# EAGLE design ACBoard2 (EAGLE 5.10)
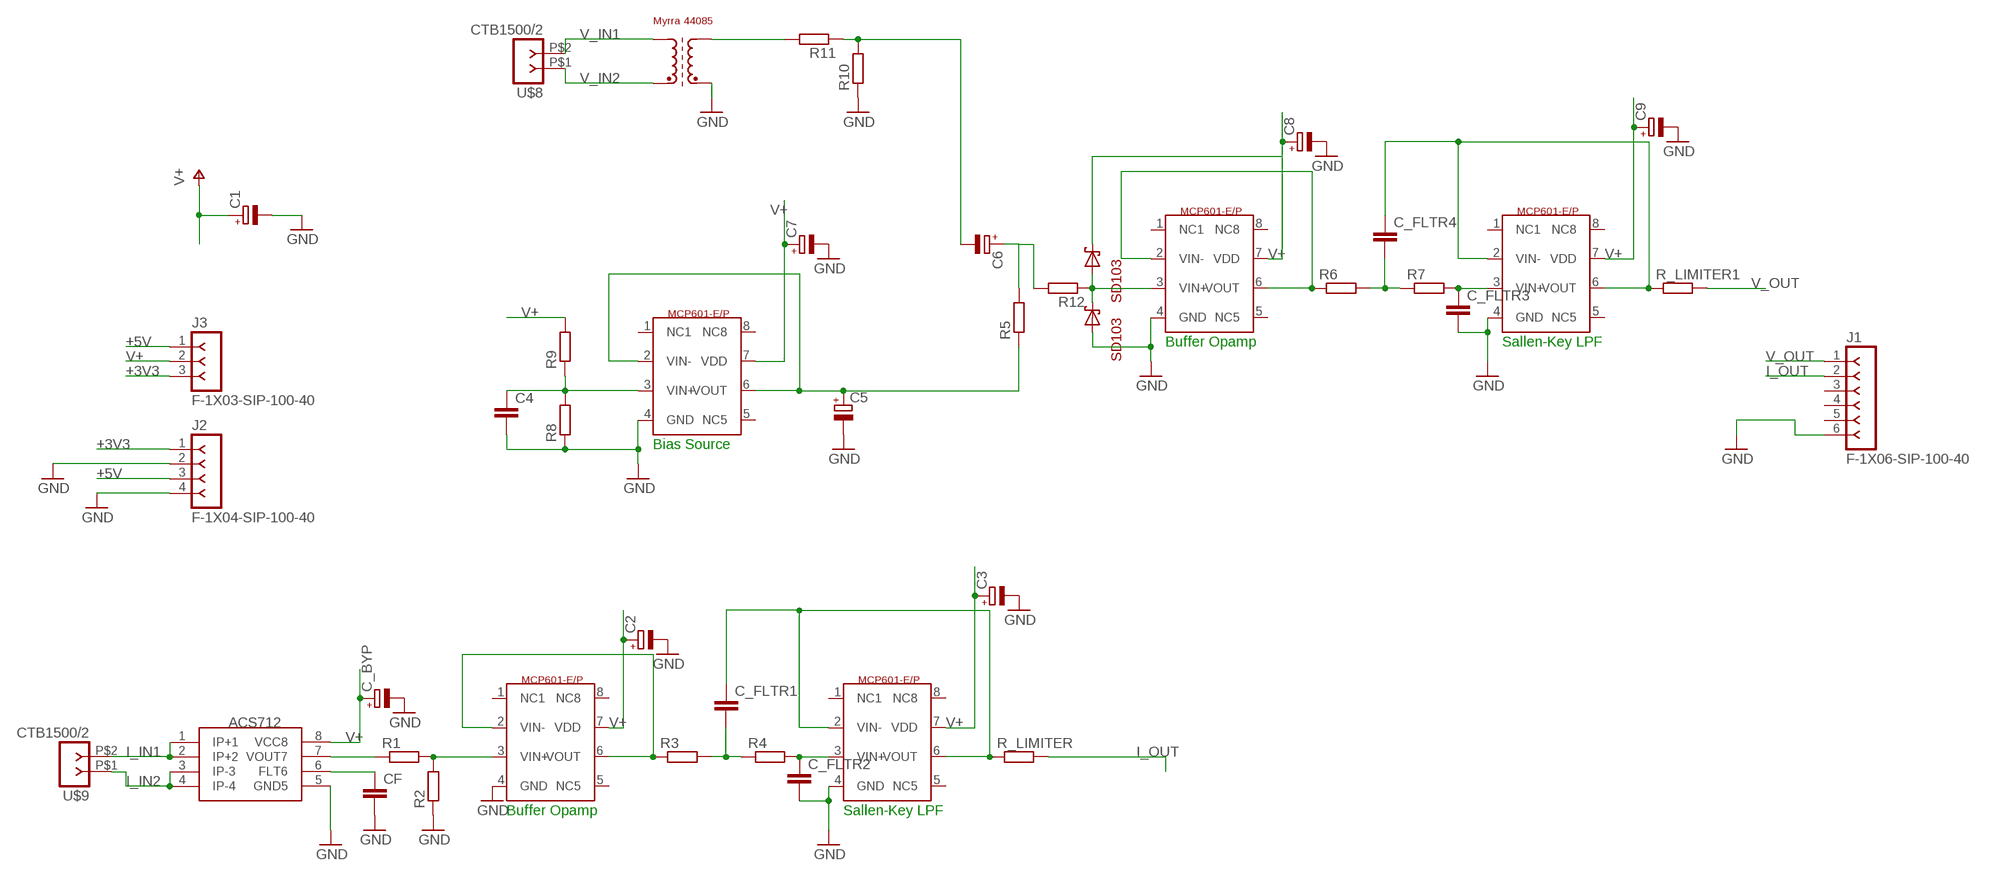
[diagram p0: schematic, sheet 1]

## Parts
BIAS  MCP601  [PDIP8]
C1  CPOL1  [E2,5-7---100UF]
C2  CPOL1  [E2,5-7---100UF]
C3  CPOL1  [E2,5-7---100UF]
C4  C5P  [C050-030-075]
C5  CPOL1  [E2,5-7---100UF]
C6  CPOL1  [E2,5-7---100UF]
C7  CPOL1  [E2,5-7---100UF]
C8  CPOL1  [E2,5-7---100UF]
C9  CPOL1  [E2,5-7---100UF]
C_BYP  CPOL1  [E2,5-7---100UF]
C_FLTR1  C5P  [C050-030-075]
C_FLTR2  C5P  [C050-030-075]
C_FLTR3  C5P  [C050-030-075]
C_FLTR4  C5P  [C050-030-075]
CF  C5P  [C050-030-075]
J1  F-1X06-SIP-100-40  [SIP-100-06-40]
J2  F-1X04-SIP-100-40  [SIP-100-04-40]
J3  F-1X03-SIP-100-40  [SIP-100-03-40]
R1  R  [0207/10]
R2  R  [0207/10]
R3  R  [0207/10]
R4  R  [0207/10]
R5  R  [0207/10]
R6  R  [0207/10]
R7  R  [0207/10]
R8  R  [0207/10]
R9  R  [0207/10]
R10  R  [0207/10]
R11  R  [0207/10]
R12  R  [0207/10]
R_LIMITER  R  [0207/10]
R_LIMITER1  R  [0207/10]
U$1  ACS712  [SOIC8]
U$2  MCP601  [PDIP8]
U$3  MCP601  [PDIP8]
U$4  MCP601  [PDIP8]
U$5  MYRRA_4408  [4408]
U$6  SD103A  [D035-10]
U$7  SD103A  [D035-10]
U$8  CTB1500/2  [CTB1500-2]
U$9  CTB1500/2  [CTB1500-2]
VOLTAGE_FOLLOWER  MCP601  [PDIP8]

## Nets
+3V3: J2.1 J3.3
+5V: J2.3 J3.1
GND: BIAS.4(GND) C1.- C2.- C3.- C4.2 C5.- C7.- C8.- C9.- C_BYP.- C_FLTR2.2 C_FLTR3.2 CF.2 J1.6 J2.2 J2.4 R2.1 R8.1 R10.1 U$1.5(GND5) U$2.4(GND) U$3.4(GND) U$4.4(GND) U$5.PIN9(E2) U$7.A VOLTAGE_FOLLOWER.4(GND)
I_IN1: U$1.1(IP+1) U$1.2(IP+2) U$9.P$2
I_IN2: U$1.3(IP-3) U$1.4(IP-4) U$9.P$1
I_OUT: J1.2 R_LIMITER.2
N$1: CF.1 U$1.6(FLT6)
N$4: R3.1 VOLTAGE_FOLLOWER.2(VIN-) VOLTAGE_FOLLOWER.6(VOUT)
N$5: R1.1 U$1.7(VOUT7)
N$6: R1.2 R2.2 VOLTAGE_FOLLOWER.3(VIN+)
N$7: C_FLTR1.1 R_LIMITER.1 U$3.2(VIN-) U$3.6(VOUT)
N$8: C_FLTR1.2 R3.2 R4.1
N$9: C_FLTR2.1 R4.2 U$3.3(VIN+)
N$10: BIAS.3(VIN+) C4.1 R8.2 R9.1
N$11: BIAS.2(VIN-) BIAS.6(VOUT) C5.+ R5.1
N$12: R12.1 U$2.3(VIN+) U$6.A U$7.C
N$13: R6.1 U$2.2(VIN-) U$2.6(VOUT)
N$14: C_FLTR4.1 R_LIMITER1.1 U$4.2(VIN-) U$4.6(VOUT)
N$15: C_FLTR4.2 R6.2 R7.1
N$16: C_FLTR3.1 R7.2 U$4.3(VIN+)
N$17: C6.- R10.2 R11.1
N$18: R11.2 U$5.PIN7(A2)
N$21: C6.+ R5.2 R12.2
V+: BIAS.7(VDD) C1.+ C2.+ C3.+ C7.+ C8.+ C9.+ C_BYP.+ J3.2 R9.2 U$1.8(VCC8) U$2.7(VDD) U$3.7(VDD) U$4.7(VDD) U$6.C VOLTAGE_FOLLOWER.7(VDD)
V_IN1: U$5.PIN5(A1) U$8.P$2
V_IN2: U$5.PIN1(E1) U$8.P$1
V_OUT: J1.1 R_LIMITER1.2
Unconnected: BIAS.1(NC1) BIAS.5(NC5) BIAS.8(NC8) J1.3 J1.4 J1.5 U$2.1(NC1) U$2.5(NC5) U$2.8(NC8) U$3.1(NC1) U$3.5(NC5) U$3.8(NC8) U$4.1(NC1) U$4.5(NC5) U$4.8(NC8) VOLTAGE_FOLLOWER.1(NC1) VOLTAGE_FOLLOWER.5(NC5) VOLTAGE_FOLLOWER.8(NC8)

## Notes on the sheet
- Buffer Opamp | Sallen-Key LPF
- Bias Source
- Buffer Opamp | Sallen-Key LPF

## Library data of the parts
BIAS U$2-U$4 VOLTAGE_FOLLOWER = Pauls_parts:MCP601
C1-C3 C5-C9 C_BYP = ee2parts:CPOL: Electrolytic (polarised) capacitor
C4 C_FLTR1-C_FLTR4 CF = ee2parts:C: Capacitor
J1 = con-headers-jp:F-1X06-: FEMALE HEADER
J2 = con-headers-jp:F-1X04-: FEMALE HEADER
J3 = con-headers-jp:F-1X03-: FEMALE HEADER
R1-R12 R_LIMITER R_LIMITER1 = ee2parts:R: Resistor
U$1 = Pauls_parts:ACS712
U$5 = Pauls_parts:MYRRA_4408
U$6 U$7 = Pauls_parts:SD103A
U$8 U$9 = eko-parts:CTB1500/2

## Board
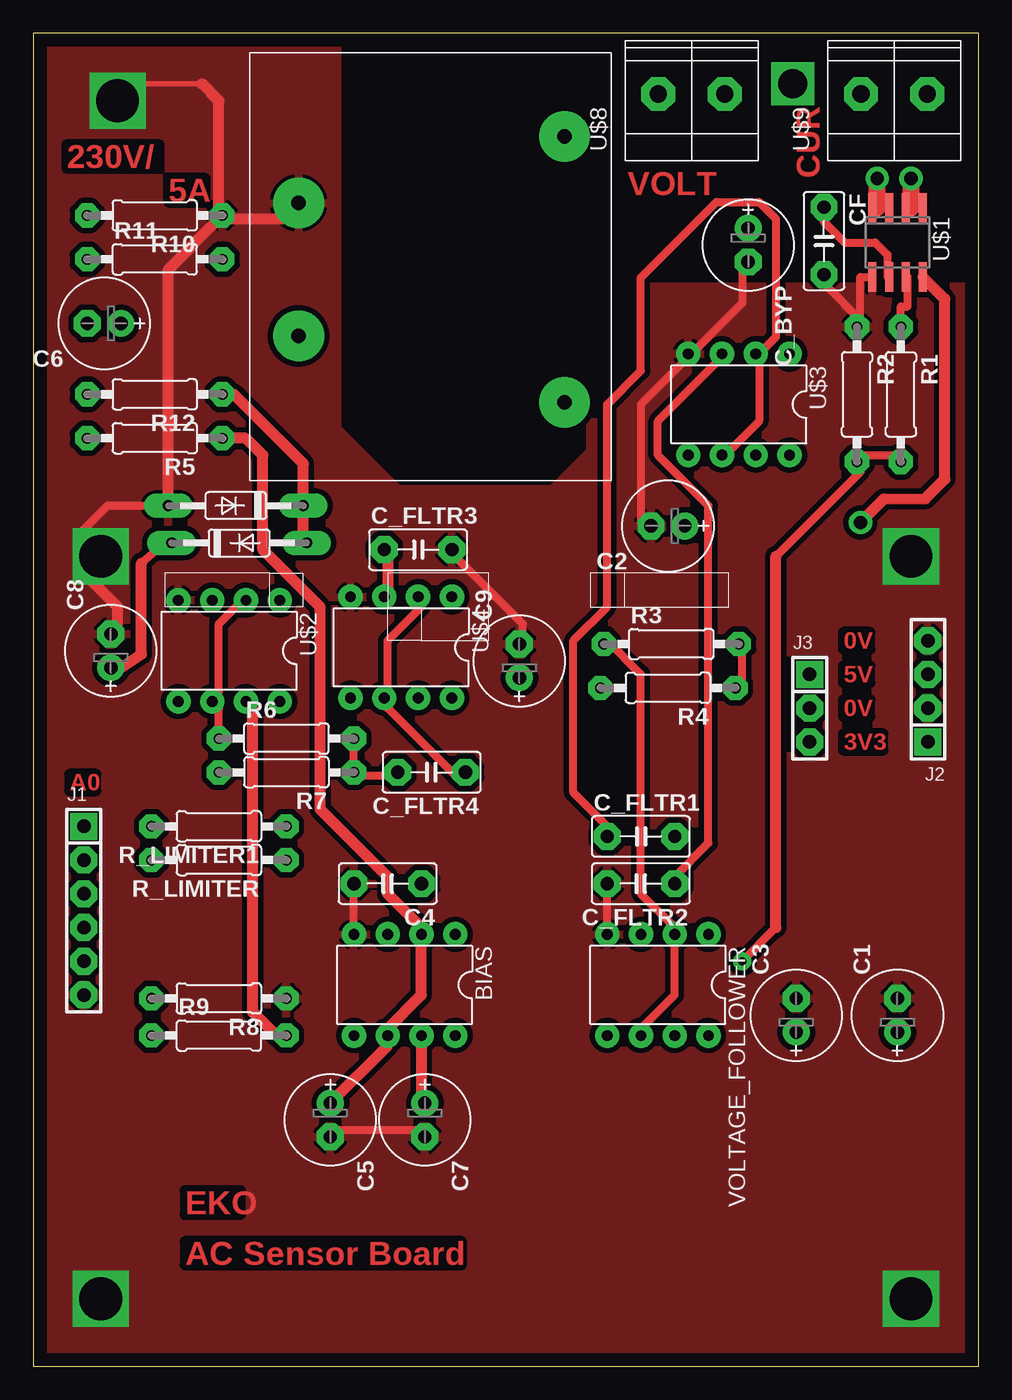
[diagram p1: board, top side]
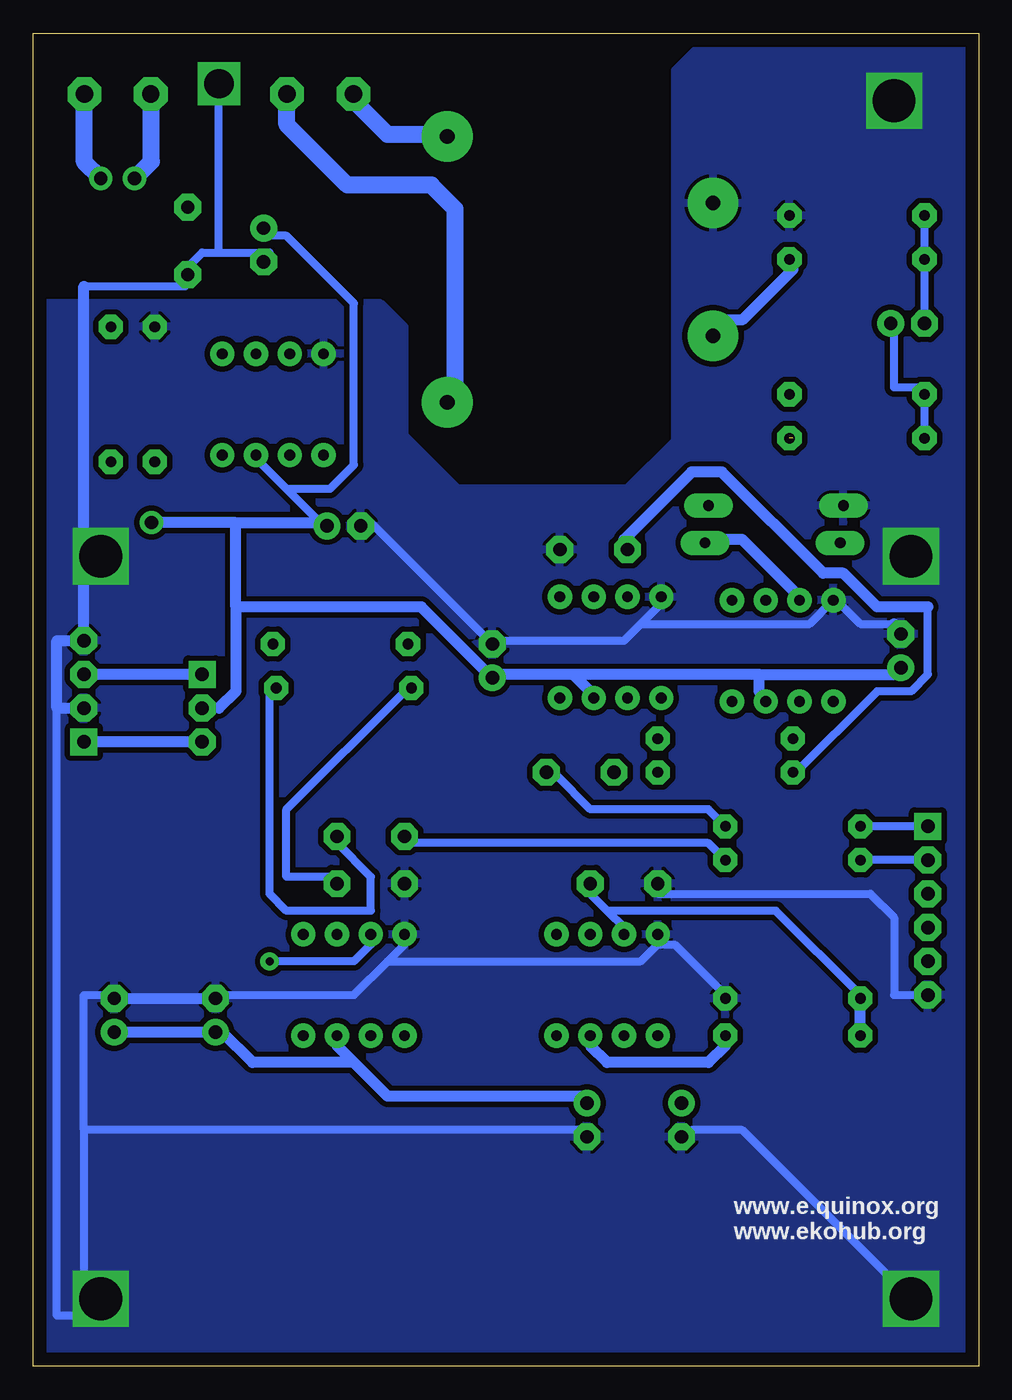
[diagram p2: board, bottom side, seen from below]

Size 71.12 x 100.33 mm. Coordinates in mm from the lower left corner, seen from the top.
Outline: 0,0 71.12,0 71.12,100.33 0,100.33 0,0
Copper layers (1*16): Top 0.035mm / dielectric 1.5mm / Bottom 0.035mm
Design rules "default *": minimum track width 24mil, minimum drill 24mil, track to track 15mil, track to pad 15mil, pad to pad 15mil, via to via 15mil, smd to smd 8mil, copper to edge 40mil, drill to drill 12mil, minimum pad ring 20mil, minimum via ring 15mil, stop-mask expansion 4mil, vias tented up to drill 0mil, thermal gap 10mil
vRestrict: area 48.3,69.8 to 58.4,74.9; area 8.9,49.5 to 20.3,57.2; area 21.6,50.8 to 33,57.1; area 41.9,25.7 to 52.1,33.3; area 22.9,25.4 to 33,31.8

### Footprints (pad centres in the part's own frame; a part is rotated, then mirrored left to right if it is on the bottom)
PDIP8 = drill 0.813 pad 1.27 round: 1 -3.81,-3.81; 2 -1.27,-3.81; 3 1.27,-3.81; 4 3.81,-3.81; 5 3.81,3.81; 6 1.27,3.81; 7 -1.27,3.81; 8 -3.81,3.81
E2,5-7---100UF = drill 1 pad 1.6 round: + -1.27,0 | drill 1 pad 1.6 octagon: - 1.27,0
C050-030-075 = drill 1 octagon: 1 -2.54,0; 2 2.54,0
SIP-100-06-40 = drill 1.016 pad 1.778 square: 1 -6.35,0 | drill 1.016 pad 1.778 octagon: 2 -3.81,0; 3 -1.27,0; 4 1.27,0; 5 3.81,0; 6 6.35,0
SIP-100-04-40 = drill 1.016 pad 1.778 square: 1 -3.81,0 | drill 1.016 pad 1.778 octagon: 2 -1.27,0; 3 1.27,0; 4 3.81,0
SIP-100-03-40 = drill 1.016 pad 1.778 square: 1 -2.54,0 | drill 1.016 pad 1.778 octagon: 2 0,0; 3 2.54,0
0207/10 = drill 0.8 octagon: 1 -5.08,0; 2 5.08,0
SOIC8 = smd 0.6 x 2.2: 1 -1.905,-2.6; 2 -0.635,-2.6; 3 0.635,-2.6; 4 1.905,-2.6; 5 1.905,2.6; 6 0.635,2.6; 7 -0.635,2.6; 8 -1.905,2.6
4408 = drill 1.1 pad 3.81 round: PIN1 -10,10; PIN5 10,10; PIN7 5,-10; PIN9 -5,-10
D035-10 = drill 0.813 long: A 4.318,0.762; C -5.842,0.762
CTB1500-2 = drill 1.3 pad 2.54 octagon: P$1 -2.5,0.5; P$2 2.5,0.5

### Placement (x,y rotation side)
BIAS  27.94,28.7 180 top
C1  65.02,26.42 90 top
C2  47.75,63.25 180 top
C3  57.4,26.42 90 top
C4  26.67,36.32 180 top
C5  22.35,18.54 270 top
C6  5.33,78.49 180 top
C7  29.46,18.54 270 top
C8  5.84,53.85 90 top
C9  36.58,53.09 90 top
C_BYP  53.79,84.39 270 top
C_FLTR1  45.72,39.88 0 top
C_FLTR2  45.72,36.32 180 top
C_FLTR3  28.96,61.47 0 top
C_FLTR4  29.97,44.7 180 top
CF  59.49,84.69 270 top
J1  3.81,34.29 270 top
J2  67.31,50.8 90 top
J3  58.42,49.53 270 top
R1  65.28,73.15 270 top
R2  61.98,73.15 270 top
R3  48.01,54.36 0 top
R4  47.75,51.05 180 top
R5  9.14,69.85 180 top
R6  19.05,47.24 0 top
R7  19.05,44.7 180 top
R8  13.97,27.69 180 top
R9  13.97,24.89 0 top
R10  9.14,86.61 180 top
R11  9.14,83.31 0 top
R12  9.14,73.15 180 top
R_LIMITER  13.97,38.1 180 top
R_LIMITER1  13.97,40.64 180 top
U$1  65.02,84.58 180 top
U$2  14.73,53.85 180 top
U$3  53.09,72.39 180 top
U$4  27.69,54.1 180 top
U$5  29.97,82.55 270 top
U$6  16.26,61.21 0 top
U$7  14.48,65.53 180 top
U$8  49.53,95.25 0 top
U$9  64.77,95.25 0 top
VOLTAGE_FOLLOWER  46.99,28.7 180 top

### Tracks (layer width: path | path; a pad name or v marks a point on that pad's centre or on a via)
+3V3
  Bottom 0.813: J3.3 J2.1
+5V
  Bottom 0.813: J3.1 J2.3
GND  (via drill 2.2 pad 0.41, 3.2 pad 0.41)
  Top 0.406: 3.81,59.69 5.08,59.69 v5.08,60.96 | 12.7,96.52 6.35,96.52 v6.35,95.25
  Top 0.61: C7.- 29.21,17.78 22.86,17.78 C5.- | BIAS.4 C4.2 | VOLTAGE_FOLLOWER.4 C_FLTR2.2 | 62.23,78.74 59.69,81.28 CF.2 | 62.23,78.74 R2.1 | 49.53,76.2 53.34,80.01 53.34,82.55 C_BYP.- | C8.- 6.35,55.88 | 3.81,59.69 3.81,62.97 5.61,64.77 U$7.A | C_FLTR3.2 31.75,60.96 36.83,55.88 36.83,54.61 C9.- | 13.97,86.36 R10.1 | 49.53,76.2 45.72,72.39 45.72,63.5 C2.- | 49.53,76.2 U$3.4 | U$1.5 62.23,81.98 62.23,78.74
  Top 0.813: 12.7,96.52 13.97,95.25 13.97,86.36 | 13.97,86.36 19.05,86.36 U$5.PIN9 | 3.81,59.69 6.35,57.15 6.35,55.88 | 13.97,86.36 10.16,82.55 U$7.A
  Bottom 0.406: v5.08,5.08 3.81,5.08 3.81,3.81 | 67.31,6.35 66.04,6.35 v66.04,5.08 | 67.31,60.96 v66.04,60.96
  Bottom 0.61: 3.81,3.81 v5.08,5.08 17.78,17.78 21.59,17.78 C5.- | 24.13,31.75 22.86,31.75 19.05,27.94 R8.1 | C4.2 24.13,35.56 8.15,35.56 6.35,33.76 6.35,27.94 J1.6 | 67.31,17.78 67.31,27.94 64.77,27.94 C1.- | 67.31,17.78 67.31,6.35 67.31,3.81 69.34,3.81 69.34,49.53 | 44.45,30.48 46.99,27.94 57.15,27.94 | 44.45,30.48 43.18,31.75 VOLTAGE_FOLLOWER.4 | 24.13,31.75 25.4,30.48 44.45,30.48 | 24.13,31.75 BIAS.4 | 67.31,17.78 29.21,17.78 C7.- | 57.15,83.82 v57.15,96.52 | 57.15,83.82 53.34,83.82 C_BYP.- | 57.15,83.82 58.42,83.82 59.69,82.55 CF.2 59.69,81.28 67.31,81.28 | 6.35,55.88 8.89,55.88 10.16,57.15 U$2.4 12.7,55.88 25.4,55.88 | 25.4,55.88 26.67,54.61 36.83,54.61 | 25.4,55.88 24.13,57.15 U$4.4 | 36.83,54.61 45.72,63.5 C2.- | 36.83,54.61 C9.-
  Bottom 0.813: 67.31,81.28 67.31,60.96 J2.4 69.34,54.61 69.34,49.53 J2.2 | 6.35,55.88 C8.- | C1.- C3.- 57.15,27.69 57.15,27.94
  pour Bottom (isolate 0.406): 0,100.33 20.02,100.33 22.86,97.49 22.86,69.63 26.45,66.04 39.16,66.04 43.18,70.06 43.18,78.21 44.98,80.01 71.12,80.01 71.12,0 0,0
  pour Top (isolate 0.406): 0,100.33 22.86,100.33 22.86,70.62 27.44,66.04 39.07,66.04 41.91,68.88 41.91,77.69 45.5,81.28 71.12,81.28 71.12,0 0,0
I_IN1  (via drill 1)
  Top 0.61: U$1.2 U$1.1 66.04,87.18
  Top 1.27: 66.04,87.18 v66.04,89.41
  Bottom 1.27: v66.04,89.41 67.27,90.64 U$9.P$2
I_IN2  (via drill 1)
  Top 0.61: U$1.3 U$1.4 63.5,87.18
  Top 1.27: 63.5,87.18 v63.5,89.41
  Bottom 0.61: 62.23,95.75 U$9.P$1
  Bottom 1.27: v63.5,89.41 62.23,90.68 62.23,95.75
I_OUT
  Bottom 0.61: J1.2 R_LIMITER.2
N$1
  Top 0.61: U$1.6 64.26,81.98 64.26,83.67 63.35,84.58 61.05,84.58 59.49,86.14 CF.1
N$4
  Top 0.61: R3.1 43.18,54.61 45.72,52.07 45.72,35.56 48.26,33.02 VOLTAGE_FOLLOWER.2 48.26,27.94 45.72,25.4 VOLTAGE_FOLLOWER.6
N$5
  Top 0.61: U$1.7 65.79,81.98 65.79,79.76 65.28,79.76 R1.1
N$6  (via drill 0.61)
  Top 0.61: R1.2 64.77,68.58 62.23,68.58 R2.2 62.23,67.31 55.88,60.96 | v53.34,30.48 55.88,33.02
  Top 0.813: 55.88,33.02 55.88,60.96
  Bottom 0.61: v53.34,30.48 46.99,30.48 45.72,31.75 VOLTAGE_FOLLOWER.3
N$7
  Top 0.61: 54.61,76.2 54.61,71.12 52.07,68.58 U$3.6 | 54.61,76.2 55.88,77.47 55.88,86.36 54.61,87.63 51.4,87.63 45.72,81.95 45.72,74.93 43.18,72.39 43.18,57.15 40.64,54.61 40.64,43.18 43.18,40.64 C_FLTR1.1 | 54.61,76.2 U$3.2
  Bottom 0.61: R_LIMITER.1 20.32,39.37 43.18,39.37 C_FLTR1.1
N$8
  Top 0.61: R4.1 53.34,50.8 53.34,54.61 R3.2
  Bottom 0.61: C_FLTR1.2 48.26,39.37 45.72,36.83 45.72,34.29 52.07,34.29 53.34,35.56 53.34,50.8 R4.1
N$9
  Top 0.61: U$3.3 52.07,76.2 46.99,71.12 46.99,68.58 50.8,64.77 50.8,39.37 48.26,36.83 C_FLTR2.1
  Bottom 0.61: R4.2 43.18,50.8 52.07,41.91 52.07,36.83 48.26,36.83 C_FLTR2.1
N$10
  Top 0.61: R8.2 8.89,27.94
  Bottom 0.61: 27.94,34.29 29.21,35.56 C4.1 | 27.94,34.29 26.67,33.02 BIAS.3 | 27.94,34.29 15.24,34.29 8.89,27.94 R8.2
  Bottom 0.813: R9.1 R8.2
N$11  (1 unrouted)
  Top 0.61: BIAS.2 29.21,33.02
  Top 0.813: C5.+ 26.67,24.13 BIAS.6 26.67,25.4 29.21,27.94 BIAS.2 | 29.21,33.02 26.67,35.56 26.67,36.83 21.59,41.91 21.59,57.15 17.27,61.47 17.27,68.56 15.98,69.85 13.97,69.85
N$12
  Top 0.813: U$6.A 20.32,62.23 U$7.C 20.32,67.92 15.09,73.15 R12.1
  Bottom 0.61: 20.32,62.23 U$6.A
  Bottom 0.813: 20.32,62.23 17.78,62.23 13.97,58.42 U$2.3
N$13
  Top 0.61: 13.97,46.99 R6.1 13.97,49.53 U$2.6 13.97,50.8 13.97,55.88 15.24,57.15 U$2.2
N$14
  Top 0.61: C_FLTR4.1 31.75,44.45 26.67,49.53 U$4.6 26.67,50.8 26.67,54.61 29.21,57.15 U$4.2
  Bottom 0.61: R_LIMITER1.1 20.32,41.91 29.21,41.91 31.75,44.45 C_FLTR4.1
N$15
  Top 0.61: R6.2 R7.1 24.13,44.45 26.67,44.45 C_FLTR4.2
N$16
  Top 0.813: U$4.3 26.67,58.42 26.67,60.96 C_FLTR3.1
  Bottom 0.61: 3.81,57.15 3.81,52.07 5.08,50.8 7.62,50.8 13.97,44.45 R7.2
  Bottom 0.813: 3.81,57.15 7.62,57.15 10.16,59.69 11.68,59.69 19.3,67.31 21.59,67.31 26.67,62.23 C_FLTR3.1
N$17
  Bottom 0.61: R10.2 R11.1 C6.-
N$18
  Bottom 0.813: R11.2 13.97,82.55 17.78,78.74 19.05,78.74 U$5.PIN7
N$21
  Bottom 0.61: C6.+ 6.35,78.74 6.35,73.66 3.81,73.66 R12.2 R5.2
V+  (via drill 1)
  Top 0.61: 16.51,49.53 U$2.7 | 8.13,60.45 10.16,62.23 U$6.C | C8.+ 6.6,52.58
  Top 0.813: BIAS.7 29.21,20.32 C7.+ | 16.51,49.53 16.51,26.67 18.29,24.89 R9.2 | 8.13,60.45 8.13,53.59 6.6,52.58 | U$1.8 68.58,80.33 68.58,66.76 67.11,65.29 63.99,65.28 v62.23,63.5
  Bottom 0.61: 48.26,24.13 VOLTAGE_FOLLOWER.7 | 52.07,66.04 49.53,63.5 C2.+ | 52.07,66.04 54.61,68.58 U$3.7 | 52.07,66.04 48.79,66.04 46.99,67.84 46.99,80.01 52.07,85.09 53.34,85.09 C_BYP.+ | 57.15,49.53 J3.2 | 36.83,52.07 C9.+ | 29.21,24.13 BIAS.7 | R9.2 19.05,24.13
  Bottom 0.813: 46.99,22.86 44.45,20.32 29.21,20.32 C7.+ | 46.99,22.86 48.26,24.13 | 46.99,22.86 54.61,22.86 56.9,25.15 C3.+ C1.+ | 30.48,52.07 29.21,50.8 U$4.7 | 30.48,52.07 36.83,52.07 41.91,57.15 55.88,57.15 | 57.15,49.53 55.88,50.8 55.88,57.15 | 55.88,57.15 55.88,63.5 | 55.88,63.5 49.53,63.5 | 16.51,52.07 30.48,52.07 | 16.51,52.07 6.35,52.07 C8.+ | 16.51,52.07 16.51,50.8 U$2.7 | 29.21,24.13 27.94,22.86 20.32,22.86 19.05,24.13 | 55.88,63.5 v62.23,63.5
V_IN1
  Bottom 0.813: U$5.PIN5 39.37,72.55
  Bottom 1.27: 39.37,72.55 39.37,87.1 41.17,88.9 47.48,88.9 52.03,93.45 U$8.P$2
V_IN2
  Bottom 1.27: U$8.P$1 46.99,95.25 44.45,92.71 40.64,92.71 U$5.PIN1
V_OUT
  Bottom 0.61: J1.1 R_LIMITER1.2

### Text on the board
Top: 230V/ | CUR | 5A | VOLT | 0V | 5V | 0V | 3V3 | A0 | EKO | AC Sensor Board
bPlace: www.e.quinox.org | www.ekohub.org